# Altium schematic sheet Stackup.SchDoc
size B; SheetNumber: 7; SheetTotal: 7
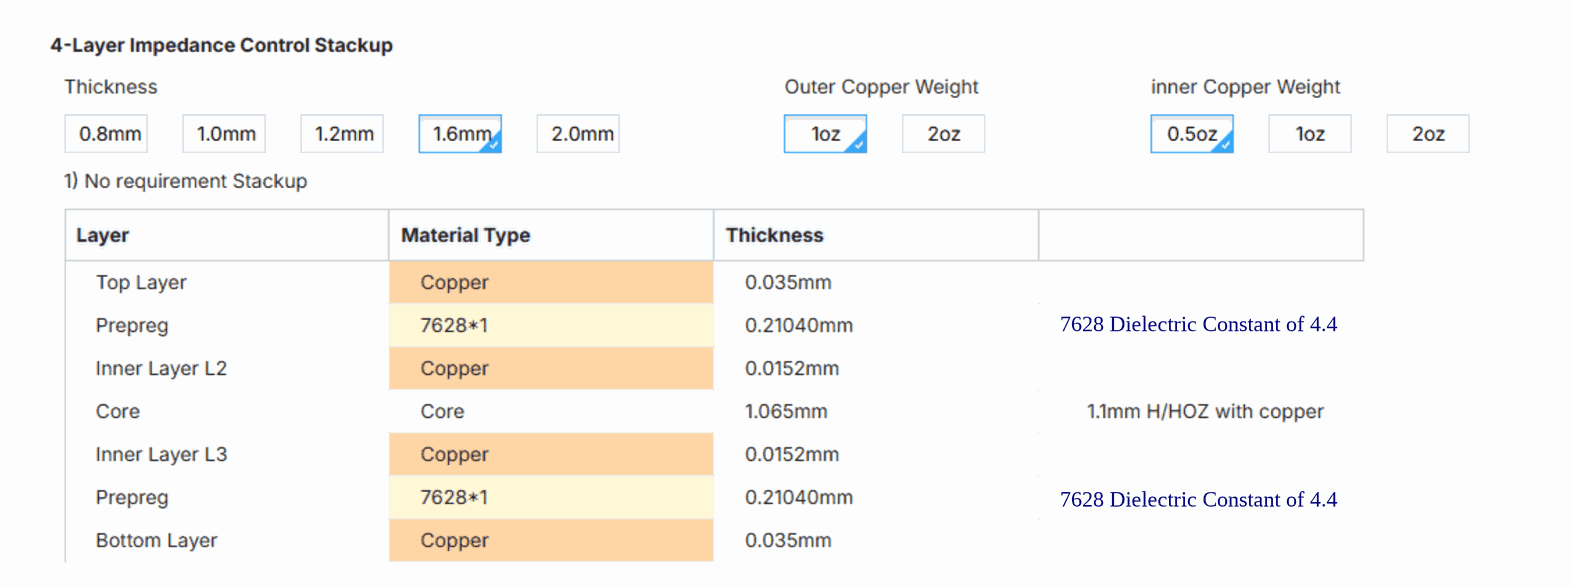
[diagram p0: Stackup.SchDoc]

## Notes on the sheet
- 7628 Dielectric Constant of 4.4